# Altium schematic sheet multiplexor circuit.SchDoc
size D; SheetNumber: 1; SheetTotal: 3
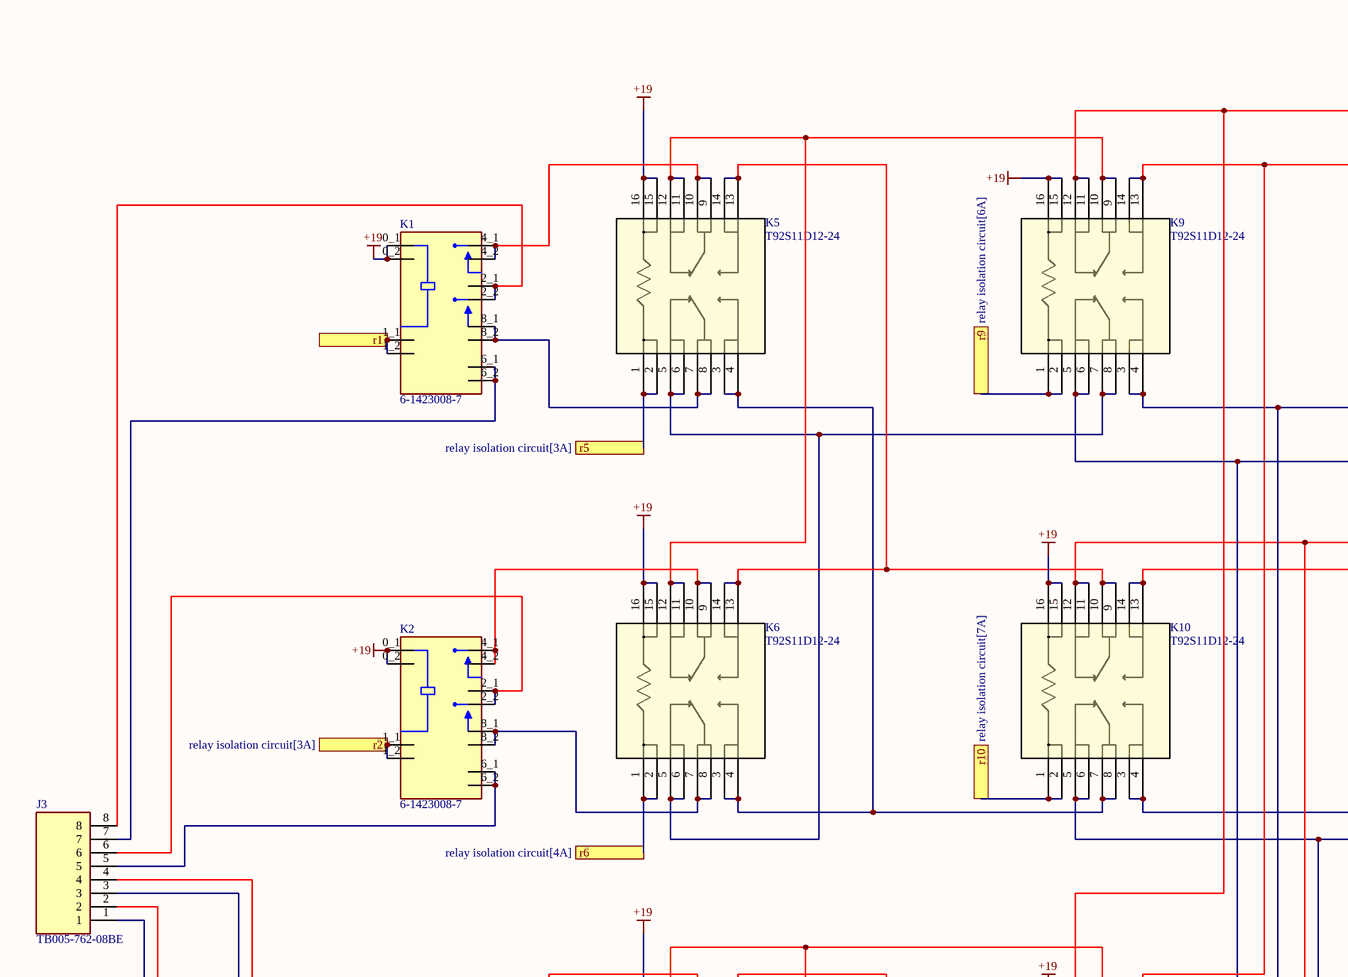
[diagram p0: multiplexor circuit.SchDoc, top left]
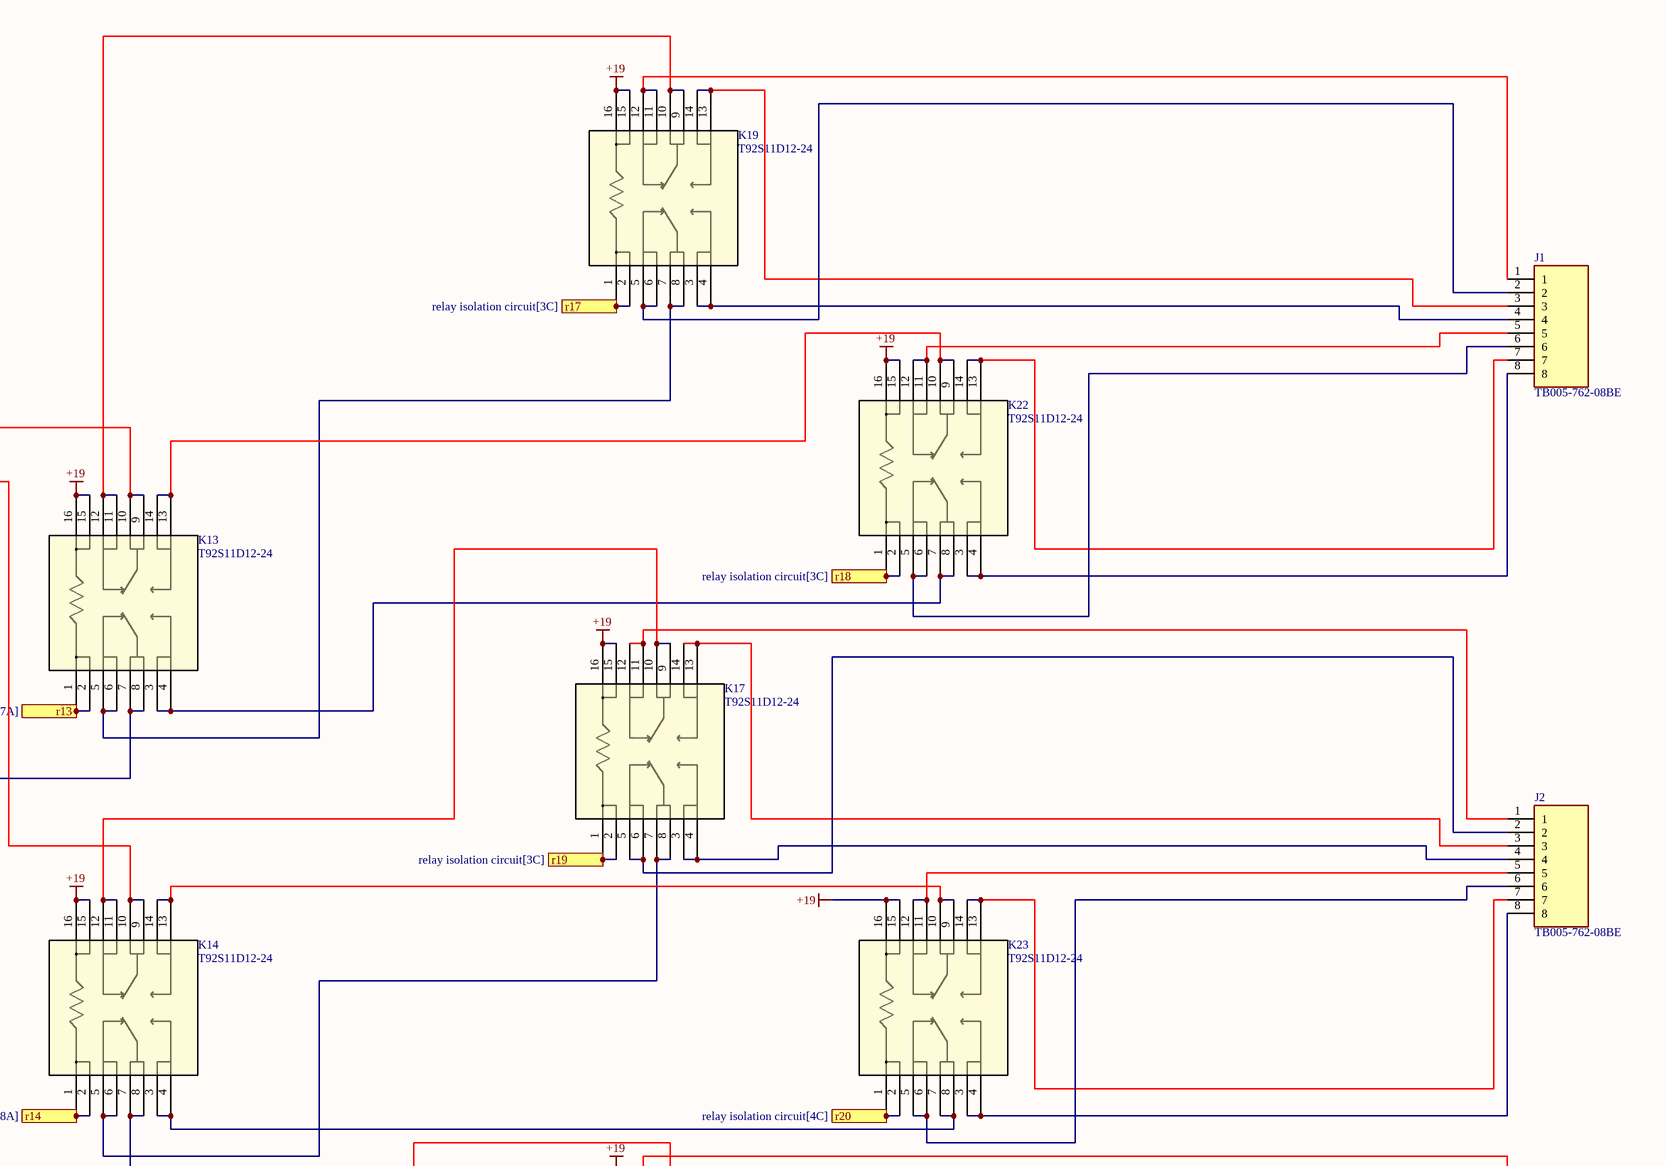
[diagram p1: multiplexor circuit.SchDoc, top right]
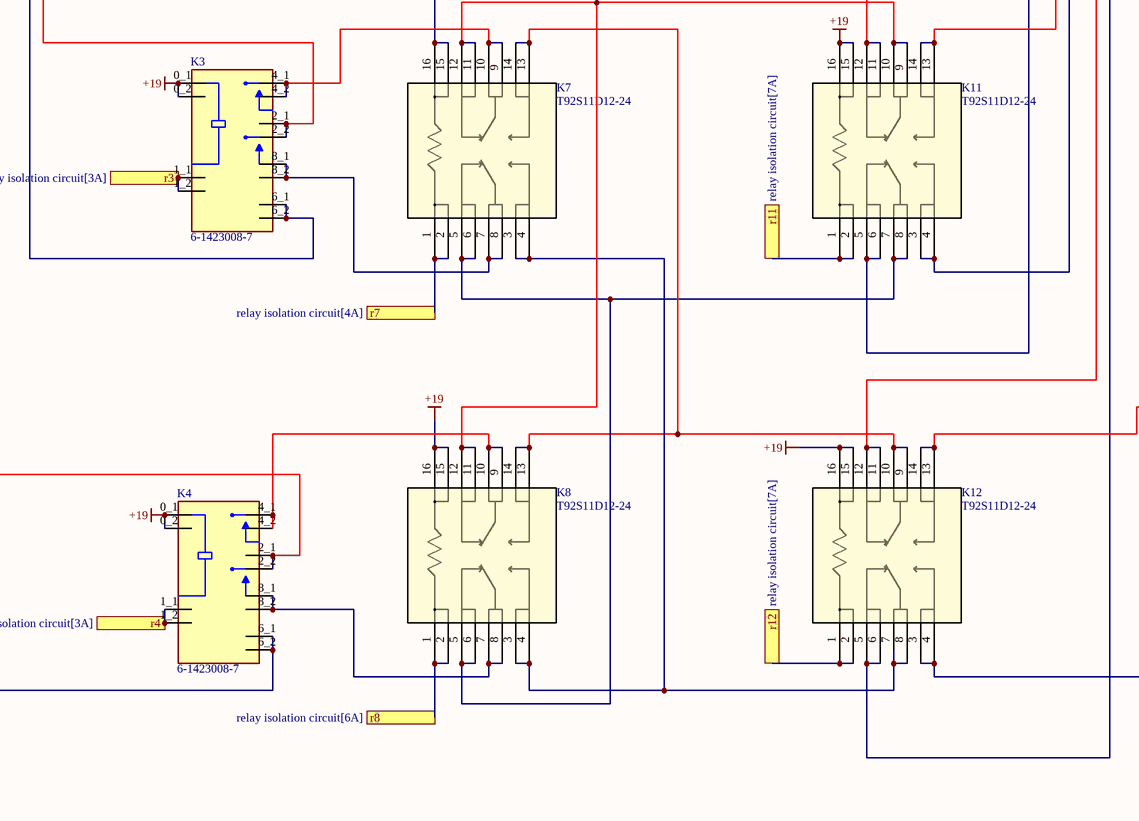
[diagram p2: multiplexor circuit.SchDoc, bottom left]
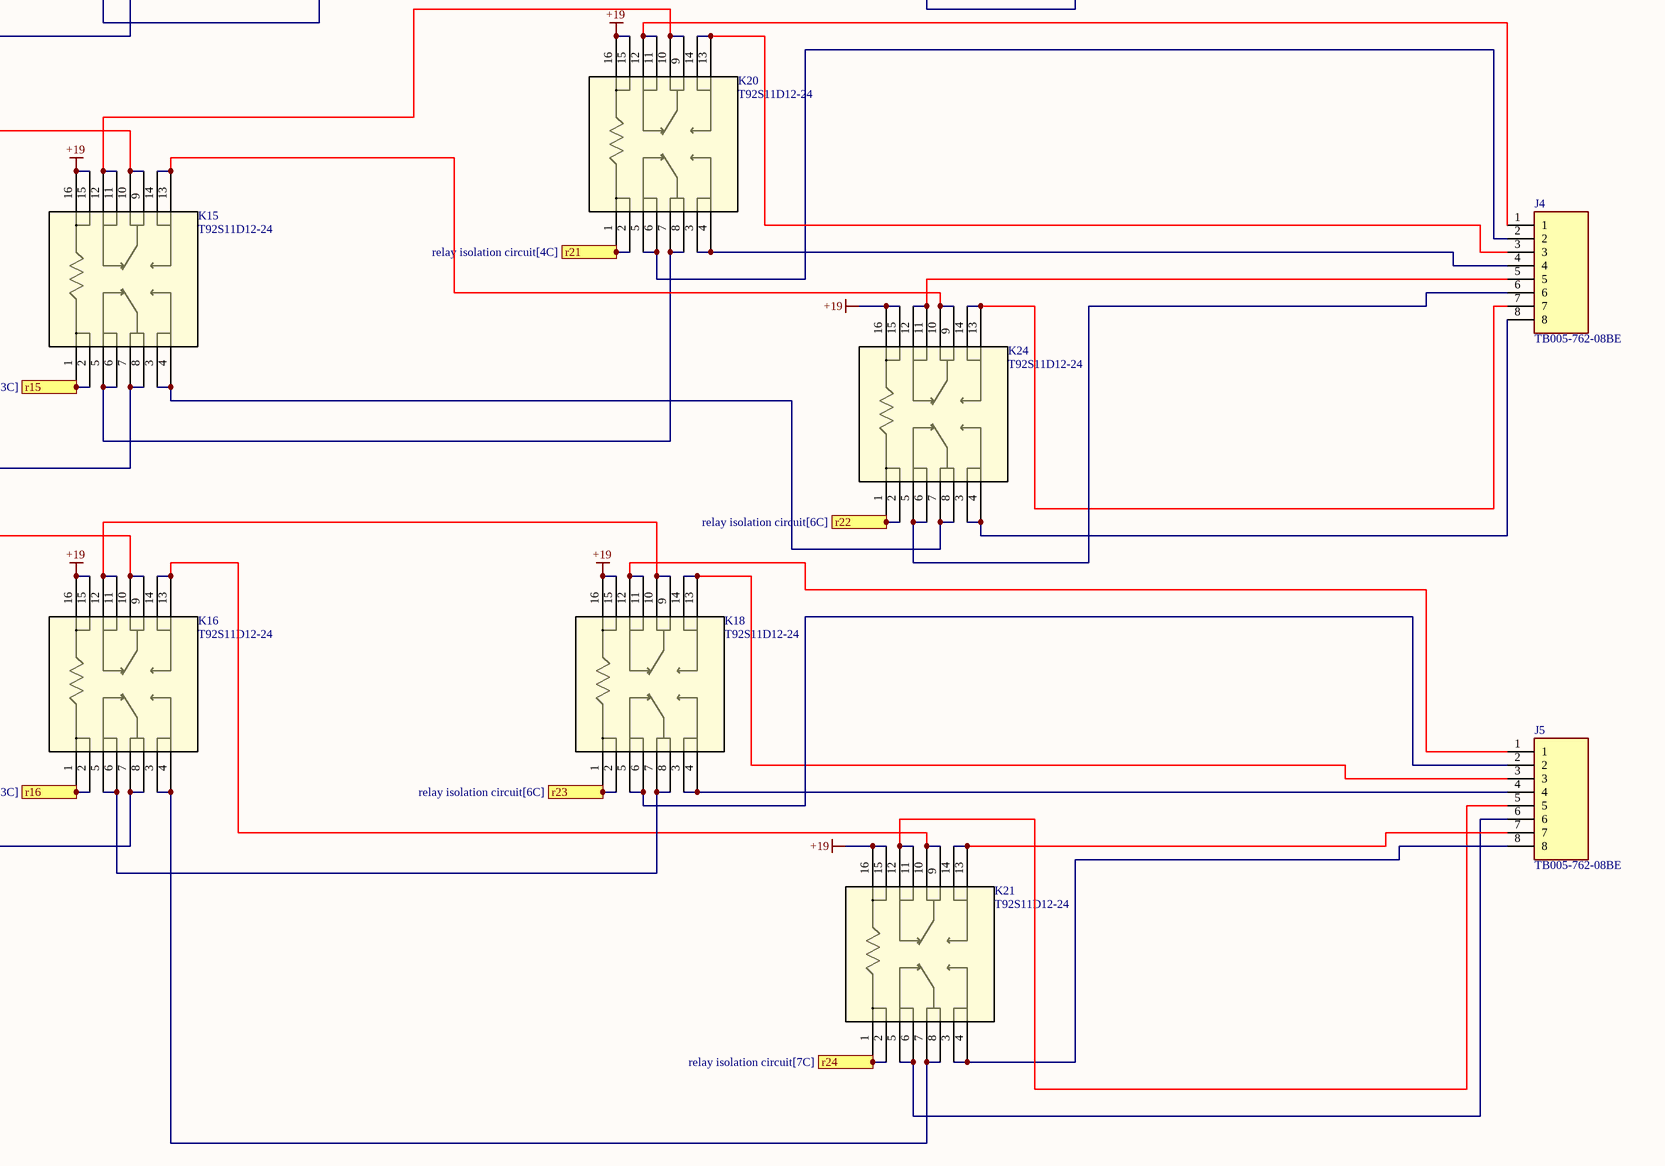
[diagram p3: multiplexor circuit.SchDoc, bottom right]

## Parts
J1  TB005-762-08BE  [CUI_TB005-762-08BE]
J2  TB005-762-08BE  [CUI_TB005-762-08BE]
J3  TB005-762-08BE  [CUI_TB005-762-08BE]
J4  TB005-762-08BE  [CUI_TB005-762-08BE]
J5  TB005-762-08BE  [CUI_TB005-762-08BE]
K1  6-1423008-7  [RELAY_6-1423008-7]
K2  6-1423008-7  [RELAY_6-1423008-7]
K3  6-1423008-7  [RELAY_6-1423008-7]
K4  6-1423008-7  [RELAY_6-1423008-7]
K5  T92S11D12-24  [T92S11D12-24_TEC-corrected]
K6  T92S11D12-24  [T92S11D12-24_TEC-corrected]
K7  T92S11D12-24  [T92S11D12-24_TEC-corrected]
K8  T92S11D12-24  [T92S11D12-24_TEC-corrected]
K9  T92S11D12-24  [T92S11D12-24_TEC-corrected]
K10  T92S11D12-24  [T92S11D12-24_TEC-corrected]
K11  T92S11D12-24  [T92S11D12-24_TEC-corrected]
K12  T92S11D12-24  [T92S11D12-24_TEC-corrected]
K13  T92S11D12-24  [T92S11D12-24_TEC-corrected]
K14  T92S11D12-24  [T92S11D12-24_TEC-corrected]
K15  T92S11D12-24  [T92S11D12-24_TEC-corrected]
K16  T92S11D12-24  [T92S11D12-24_TEC-corrected]
K17  T92S11D12-24  [T92S11D12-24_TEC-corrected]
K18  T92S11D12-24  [T92S11D12-24_TEC-corrected]
K19  T92S11D12-24  [T92S11D12-24_TEC-corrected]
K20  T92S11D12-24  [T92S11D12-24_TEC-corrected]
K21  T92S11D12-24  [T92S11D12-24_TEC-corrected]
K22  T92S11D12-24  [T92S11D12-24_TEC-corrected]
K23  T92S11D12-24  [T92S11D12-24_TEC-corrected]
K24  T92S11D12-24  [T92S11D12-24_TEC-corrected]

## Ports
r1 (see relay isolation circuit[3A]), r2 (see relay isolation circuit[3A]), r3 (see relay isolation circuit[3A]), r4 (see relay isolation circuit[3A]), r5 (see relay isolation circuit[3A]), r6 (see relay isolation circuit[4A]), r7 (see relay isolation circuit[4A]), r8 (see relay isolation circuit[6A]), r9 (see relay isolation circuit[6A]), r10 (see relay isolation circuit[7A]), r11 (see relay isolation circuit[7A]), r12 (see relay isolation circuit[7A]), r13 (see relay isolation circuit[7A]), r14 (see relay isolation circuit[8A]), r15 (see relay isolation circuit[3C]), r16 (see relay isolation circuit[3C]), r17 (see relay isolation circuit[3C]), r18 (see relay isolation circuit[3C]), r19 (see relay isolation circuit[3C]), r20 (see relay isolation circuit[4C]), r21 (see relay isolation circuit[4C]), r22 (see relay isolation circuit[6C]), r23 (see relay isolation circuit[6C]), r24 (see relay isolation circuit[7C])

## Nets
+19: K1.0_1(COIL1) K1.0_2(COIL1) K2.0_1(COIL1) K2.0_2(COIL1) K3.0_1(COIL1) K3.0_2(COIL1) K4.0_1(COIL1) K4.0_2(COIL1) K5.15 K5.16 K6.15 K6.16 K7.15 K7.16 K8.15 K8.16 K9.15 K9.16 K10.15 K10.16 K11.15 K11.16 K12.15 K12.16 K13.15 K13.16 K14.15 K14.16 K15.15 K15.16 K16.15 K16.16 K17.15 K17.16 K18.15 K18.16 K19.15 K19.16 K20.15 K20.16 K21.15 K21.16 K22.15 K22.16 K23.15 K23.16 K24.15 K24.16
r1: K1.1_1(COIL2) K1.1_2(COIL2) ; port r1
r2: K2.1_1(COIL2) K2.1_2(COIL2) ; port r2
r3: K3.1_1(COIL2) K3.1_2(COIL2) ; port r3
r4: K4.1_1(COIL2) K4.1_2(COIL2) ; port r4
r5: K5.1 K5.2 ; port r5
r6: K6.1 K6.2 ; port r6
r7: K7.1 K7.2 ; port r7
r8: K8.1 K8.2 ; port r8
r9: K9.1 K9.2 ; port r9
r10: K10.1 K10.2 ; port r10
r11: K11.1 K11.2 ; port r11
r12: K12.1 K12.2 ; port r12
r13: K13.1 K13.2 ; port r13
r14: K14.1 K14.2 ; port r14
r15: K15.1 K15.2 ; port r15
r16: K16.1 K16.2 ; port r16
r17: K19.1 K19.2 ; port r17
r18: K22.1 K22.2 ; port r18
r19: K17.1 K17.2 ; port r19
r20: K23.1 K23.2 ; port r20
r21: K20.1 K20.2 ; port r21
r22: K24.1 K24.2 ; port r22
r23: K18.1 K18.2 ; port r23
r24: K21.1 K21.2 ; port r24
NetJ1_1: J1.1 K19.11 K19.12
NetJ1_2: J1.2 K19.5 K19.6
NetJ1_3: J1.3 K19.13 K19.14
NetJ1_4: J1.4 K19.3 K19.4
NetJ1_5: J1.5 K22.11 K22.12
NetJ1_6: J1.6 K22.5 K22.6
NetJ1_7: J1.7 K22.13 K22.14
NetJ1_8: J1.8 K22.3 K22.4
NetJ2_1: J2.1 K17.11 K17.12
NetJ2_2: J2.2 K17.5 K17.6
NetJ2_3: J2.3 K17.13 K17.14
NetJ2_4: J2.4 K17.3 K17.4
NetJ2_5: J2.5 K23.11 K23.12
NetJ2_6: J2.6 K23.5 K23.6
NetJ2_7: J2.7 K23.13 K23.14
NetJ2_8: J2.8 K23.3 K23.4
NetJ3_1: J3.1 K4.6_1(NO2) K4.6_2(NO2)
NetJ3_2: J3.2 K4.2_1(NO1) K4.2_2(NO1)
NetJ3_3: J3.3 K3.6_1(NO2) K3.6_2(NO2)
NetJ3_4: J3.4 K3.2_1(NO1) K3.2_2(NO1)
NetJ3_5: J3.5 K2.6_1(NO2) K2.6_2(NO2)
NetJ3_6: J3.6 K2.2_1(NO1) K2.2_2(NO1)
NetJ3_7: J3.7 K1.6_1(NO2) K1.6_2(NO2)
NetJ3_8: J3.8 K1.2_1(NO1) K1.2_2(NO1)
NetJ4_1: J4.1 K20.11 K20.12
NetJ4_2: J4.2 K20.5 K20.6
NetJ4_3: J4.3 K20.13 K20.14
NetJ4_4: J4.4 K20.3 K20.4
NetJ4_5: J4.5 K24.11 K24.12
NetJ4_6: J4.6 K24.5 K24.6
NetJ4_7: J4.7 K24.13 K24.14
NetJ4_8: J4.8 K24.3 K24.4
NetJ5_1: J5.1 K18.11 K18.12
NetJ5_2: J5.2 K18.5 K18.6
NetJ5_3: J5.3 K18.13 K18.14
NetJ5_4: J5.4 K18.3 K18.4
NetJ5_5: J5.5 K21.11 K21.12
NetJ5_6: J5.6 K21.5 K21.6
NetJ5_7: J5.7 K21.13 K21.14
NetJ5_8: J5.8 K21.3 K21.4
NetK1_4_1: K1.4_1(COM1) K1.4_2(COM1) K5.9 K5.10
NetK1_8_1: K1.8_1(COM2) K1.8_2(COM2) K5.7 K5.8
NetK2_4_1: K2.4_1(COM1) K2.4_2(COM1) K6.9 K6.10
NetK2_8_1: K2.8_1(COM2) K2.8_2(COM2) K6.7 K6.8
NetK3_4_1: K3.4_1(COM1) K3.4_2(COM1) K7.9 K7.10
NetK3_8_1: K3.8_1(COM2) K3.8_2(COM2) K7.7 K7.8
NetK4_4_1: K4.4_1(COM1) K4.4_2(COM1) K8.9 K8.10
NetK4_8_1: K4.8_1(COM2) K4.8_2(COM2) K8.7 K8.8
NetK5_3: K5.3 K5.4 K6.3 K6.4 K10.7 K10.8
NetK5_5: K5.5 K5.6 K6.5 K6.6 K9.7 K9.8
NetK5_11: K5.11 K5.12 K6.11 K6.12 K9.9 K9.10
NetK5_13: K5.13 K5.14 K6.13 K6.14 K10.9 K10.10
NetK7_3: K7.3 K7.4 K8.3 K8.4 K12.7 K12.8
NetK7_5: K7.5 K7.6 K8.5 K8.6 K11.7 K11.8
NetK7_11: K7.11 K7.12 K8.11 K8.12 K11.9 K11.10
NetK7_13: K7.13 K7.14 K8.13 K8.14 K12.9 K12.10
NetK9_3: K9.3 K9.4 K11.3 K11.4 K14.7 K14.8
NetK9_5: K9.5 K9.6 K11.5 K11.6 K13.7 K13.8
NetK9_11: K9.11 K9.12 K11.11 K11.12 K13.9 K13.10
NetK9_13: K9.13 K9.14 K11.13 K11.14 K14.9 K14.10
NetK10_3: K10.3 K10.4 K12.3 K12.4 K16.7 K16.8
NetK10_5: K10.5 K10.6 K12.5 K12.6 K15.7 K15.8
NetK10_11: K10.11 K10.12 K12.11 K12.12 K15.9 K15.10
NetK10_13: K10.13 K10.14 K12.13 K12.14 K16.9 K16.10
NetK13_3: K13.3 K13.4 K22.7 K22.8
NetK13_5: K13.5 K13.6 K19.7 K19.8
NetK13_11: K13.11 K13.12 K19.9 K19.10
NetK13_13: K13.13 K13.14 K22.9 K22.10
NetK14_3: K14.3 K14.4 K23.7 K23.8
NetK14_5: K14.5 K14.6 K17.7 K17.8
NetK14_11: K14.11 K14.12 K17.9 K17.10
NetK14_13: K14.13 K14.14 K23.9 K23.10
NetK15_3: K15.3 K15.4 K24.7 K24.8
NetK15_5: K15.5 K15.6 K20.7 K20.8
NetK15_11: K15.11 K15.12 K20.9 K20.10
NetK15_13: K15.13 K15.14 K24.9 K24.10
NetK16_3: K16.3 K16.4 K21.7 K21.8
NetK16_5: K16.5 K16.6 K18.7 K18.8
NetK16_11: K16.11 K16.12 K18.9 K18.10
NetK16_13: K16.13 K16.14 K21.9 K21.10

## Library data of the parts
K1-K4 = 6-1423008-7: General Purpose Relay DPST-NO (2 Form A) 24VDC Coil Through Hole; MF: TE Connectivity / P&B; MP: 6-1423008-7; Package: None; Purchase-URL: https://pricing.snapeda.com/search/part/6-1423008-7/?ref=eda; Price: None; Value: *; SnapEDA_Link: https://www.snapeda.com/parts/6-1423008-7/TE%20Connectivity/view-part/6301405/?ref=snap; Check_prices: https://www.snapeda.com/parts/6-1423008-7/TE%20Connectivity/view-part/6301405/?ref=eda; Availability: In Stock
K5-K24 = T92S11D12-24: No Description Available; Mfr_Name: TE Connectivity; Copyright: Copyright (C) 2022 Ultra Librarian. All rights reserved.; Manufacturer_Part_Number: T92S11D12-24; Digi-Key_Part_Number_1: PB352-ND; RefDes: RefDes; Type: DEV
J1-J5 = TB005-762-08BE: Package: None; Price: None; Value: *; MP: TB005-762-08BE; Availability: Unavailable